# Altium schematic sheet PDOC.SchDoc
size A4
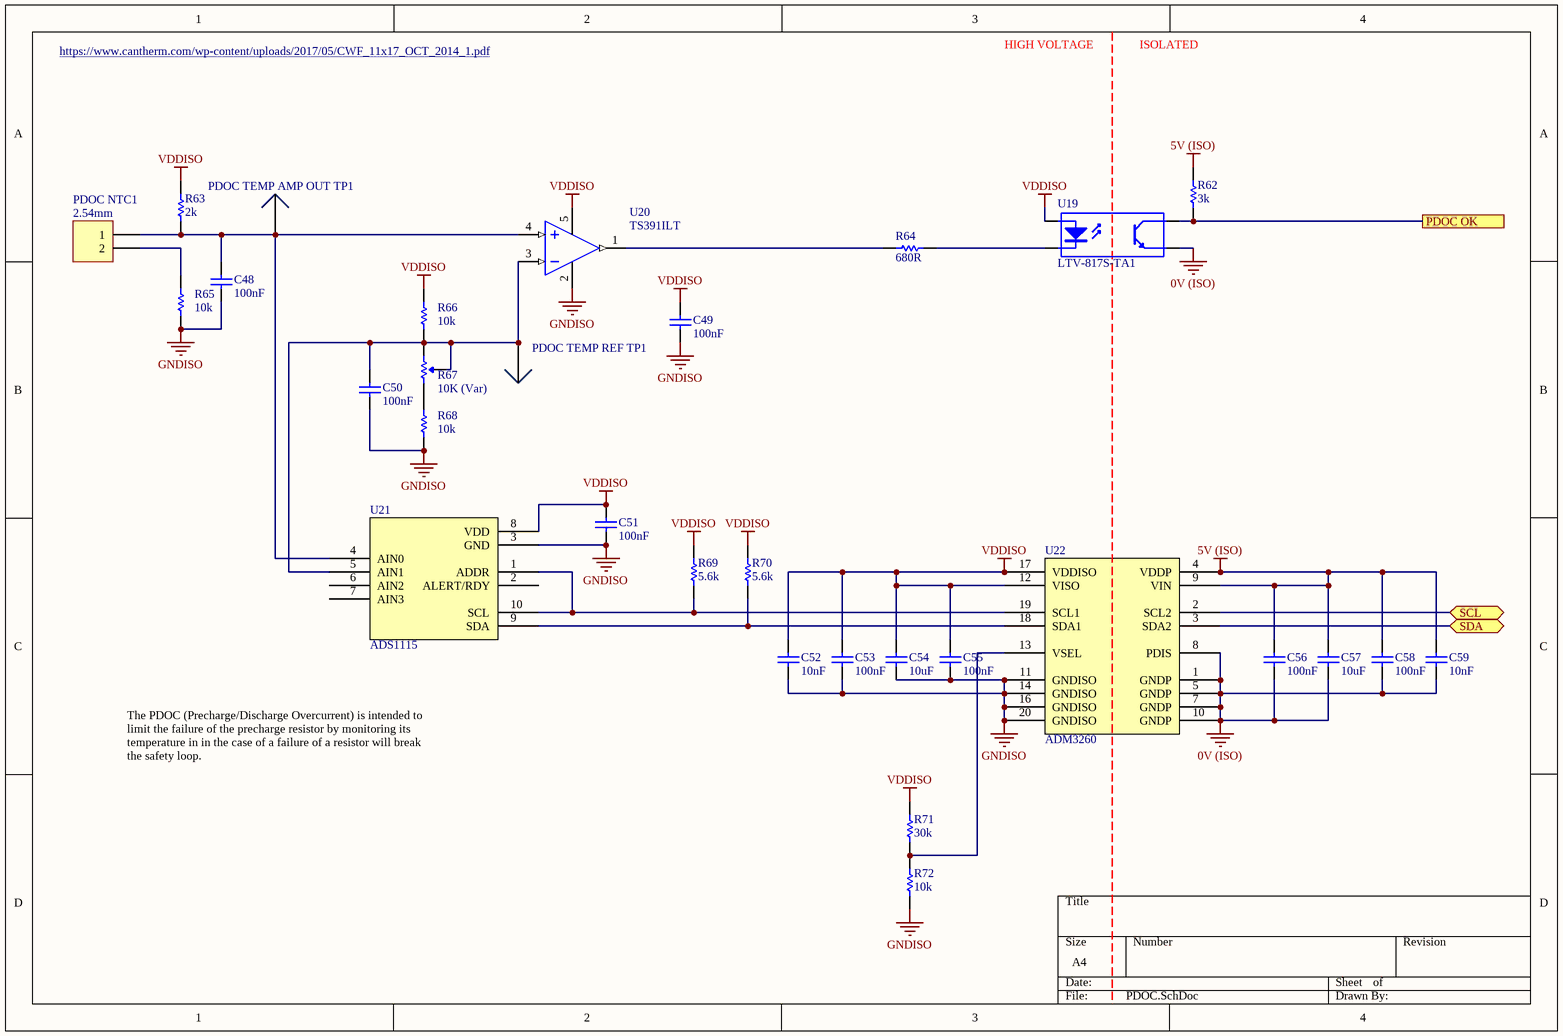
[diagram p0: PDOC.SchDoc]

## Parts
C48  100nF  [0805]
C49  100nF  [0805]
C50  100nF  [0805]
C51  100nF  [0805]
C52  10nF  [0805]
C53  100nF  [0805]
C54  10uF  [0805]
C55  100nF  [0805]
C56  100nF  [0805]
C57  10uF  [0805]
C58  100nF  [0805]
C59  10nF  [0805]
PDOC_NTC1  2.54mm  [TH 2.54mm Header 1x2]
PDOC_TEMP_AMP_OUT_TP1  0mm  [SMD Test Point]  (value not drawn)
PDOC_TEMP_REF_TP1  0mm  [SMD Test Point]  (value not drawn)
R62  3k  [0805]
R63  2k  [0805]
R64  680R  [0805]
R65  10k  [0805]
R66  10k  [0805]
R67  10K (Var)  [B 3296]
R68  10k  [0805]
R69  5.6k  [0805]
R70  5.6k  [0805]
R71  30k  [0805]
R72  10k  [0805]
U19  LTV-817S-TA1  [ON 4-SMD]
U20  TS391ILT  [ON SOT-23-5]
U21  ADS1115  [TI 10-VSSOP]
U22  ADM3260  [AD 20-SSOP]

## Ports
PDOC OK, SCL (bidir), SDA (bidir)

## Nets
0V (ISO): C56.1 C57.1 C58.1 C59.1 U19.3(E) U22.1(GNDP) U22.5(GNDP) U22.7(GNDP) U22.8(PDIS) U22.10(GNDP)
5V (ISO): C56.2 C57.2 C58.2 C59.2 R62.2 U22.4(VDDP) U22.9(VIN)
GNDISO: C48.1 C49.1 C50.1 C51.2 C52.1 C53.1 C54.1 C55.2 R65.1 R68.1 R72.1 U20.2(VCC-) U21.3(GND) U22.11(GNDISO) U22.14(GNDISO) U22.16(GNDISO) U22.20(GNDISO)
VDDISO: C49.2 C51.1 C52.2 C53.2 C54.2 C55.1 R63.2 R66.2 R69.2 R70.2 R71.2 U19.1(A) U20.5(VCC+) U21.8(VDD) U22.12(VISO) U22.17(VDDISO)
PDOC OK: R62.1 U19.4(C) ; port PDOC OK
SCL: U22.2(SCL2) ; port SCL
SDA: U22.3(SDA2) ; port SDA
NetC48_2: C48.2 PDOC_NTC1.1 PDOC_TEMP_AMP_OUT_TP1.1 R63.1 U20.4(IIN+) U21.4(AIN0)
NetC50_2: C50.2 PDOC_TEMP_REF_TP1.1 R66.1 R67.1(CCW) R67.2(Wiper) U20.3(IN-) U21.5(AIN1)
NetPDOC_NTC1_2: PDOC_NTC1.2 R65.2
NetR64_1: R64.1 U20.1(OUT)
NetR64_2: R64.2 U19.2(K)
NetR67_3: R67.3(CW) R68.2
NetR69_1: R69.1 U21.1(ADDR) U21.10(SCL) U22.19(SCL1)
NetR70_1: R70.1 U21.9(SDA) U22.18(SDA1)
NetR71_1: R71.1 R72.2 U22.13(VSEL)

Not connected (* = marked no-connect by the designer): U21 2(ALERT/RDY) 6(AIN2) 7(AIN3)

## Notes on the sheet
- https://www.cantherm.com/wp-content/uploads/2017/05/CWF_11x17_OCT_2014_1.pdf
- HIGH VOLTAGE
- ISOLATED
- The PDOC (Precharge/Discharge Overcurrent) is intended to limit the failure of the precharge resistor by monitoring its temperature in in the case of a failure of a resistor will break the safety loop.

## Library data of the parts
C48-C51 C53 C55 C56 C58 = GCM21BR71E104KA37L: Manufacturer: muRata; Tolerance: 10%; Material: X7R; Rated Voltage: 25V; Part Number: GCM21BR71E104KA37L; Value: 100nF
C52 C59 = GCM21BR71H103KA37L: Manufacturer: muRata; Tolerance: 10%; Material: X7R; Rated Voltage: 50V; Part Number: GCM21BR71H103KA37L; Value: 10nF
C54 C57 = GRM21BR6YA106KE43L: Manufacturer: muRata; Tolerance: 10%; Material: X5R; Rated Voltage: 50V; Part Number: GRM21BR6YA106KE43L; Value: 10uF; Digikey Part Number: 490-10514-6-ND
PDOC_NTC1 = TH 2.54mm Header 1x2: Positions: 2; Angle: 0; Flange: No; Contact: NA; Part Number: TH 2.54mm Header 1x2; Pitch: 2.54mm; Row Spacing: 2.54mm
PDOC_TEMP_AMP_OUT_TP1 PDOC_TEMP_REF_TP1 = SMD Test Point: Positions: 1; Row Spacing: 0; Flange: No; Contact: NA; Part Number: SMD Test Point; Pitch: 0mm; Angle: 0
R62 = RC0805FR073KL: Manufacturer: YAGEO; Tolerance: 0.01; Rated Voltage: 0.125W; Part Number: RC0805FR073KL; Value: 3k; Material: FR-07
R63 = RC0805FR072KL: Manufacturer: YAGEO; Tolerance: 0.01; Rated Voltage: 0.125W; Part Number: RC0805FR072KL; Value: 2k; Material: FR-07
R64 = RC0805FR07680RL: Manufacturer: YAGEO; Tolerance: 0.01; Rated Voltage: 0.125W; Part Number: RC0805FR07680RL; Value: 680R; Material: FR-07
R65 R66 R68 R72 = RC0805FR0710KL: Manufacturer: YAGEO; Tolerance: 0.01; Rated Voltage: 0.125W; Part Number: RC0805FR0710KL; Value: 10k; Material: FR-07
R67 = 3296W-1-103LF: Manufacturer: Bournes Inc; Tolerance: 0.1; Rated Voltage: 0.5W; Part Number: 3296W-1-103LF; Value: 10K (Var); Digikey Part Number: 3296W-103LF-ND
R69 R70 = RC0805FR075K6L: Manufacturer: YAGEO; Tolerance: 0.01; Rated Voltage: 0.125W; Part Number: RC0805FR075K6L; Value: 5.6k; Material: FR-07
R71 = RC0805FR0730KL: Manufacturer: YAGEO; Tolerance: 0.01; Rated Voltage: 0.125W; Part Number: RC0805FR0730KL; Value: 30k; Material: FR-07
U19 = LTV-817S-TA1: 35V 50ma Optocoupler (VF=1.2V); Manufacturer: Lite-On Inc; Part Number: LTV-817S-TA1; Digikey Part Number: 160-1893-2-ND; Digikey Link: https://www.digikey.com/product-detail/en/lite-on-inc/LTV-817S-TA1/160-1893-2-ND/388451
U20 = TS391ILT: IC COMP LO PWR SGL V SOT 23-5L; Manufacturer: STMicroelectronics; Part Number: TS391ILT; Digikey Part Number: 497-2275-2-ND; Digikey Link: https://www.digikey.com/product-detail/en/stmicroelectronics/TS391ILT/497-2275-2-ND/599407
U21 = ADS1115: 16 Bit Analog to Digital Converter 2, 4 Input 1 Sigma-Delta 10-VSSOP; Manufacturer: Texas Instruments; Part Number: ADS1115; Digikey Part Number: 296-38849-1-ND; Digikey Link: https://www.digikey.com/product-detail/en/texas-instruments/ADS1115IDGSR/296-38849-1-ND/5142969
U22 = ADM3260: I²C Digital Isolator 2500Vrms 2 Channel 25kV/µs CMTI 20-SSOP (0.209", 5.30mm Width); Manufacturer: Analog Devices; Part Number: ADM3260; Digikey Part Number: ADM3260ARSZ-RL7CT-ND; Digikey Link: https://www.digikey.com/product-detail/en/analog-devices-inc/ADM3260ARSZ-RL7/ADM3260ARSZ-RL7CT-ND/5233040